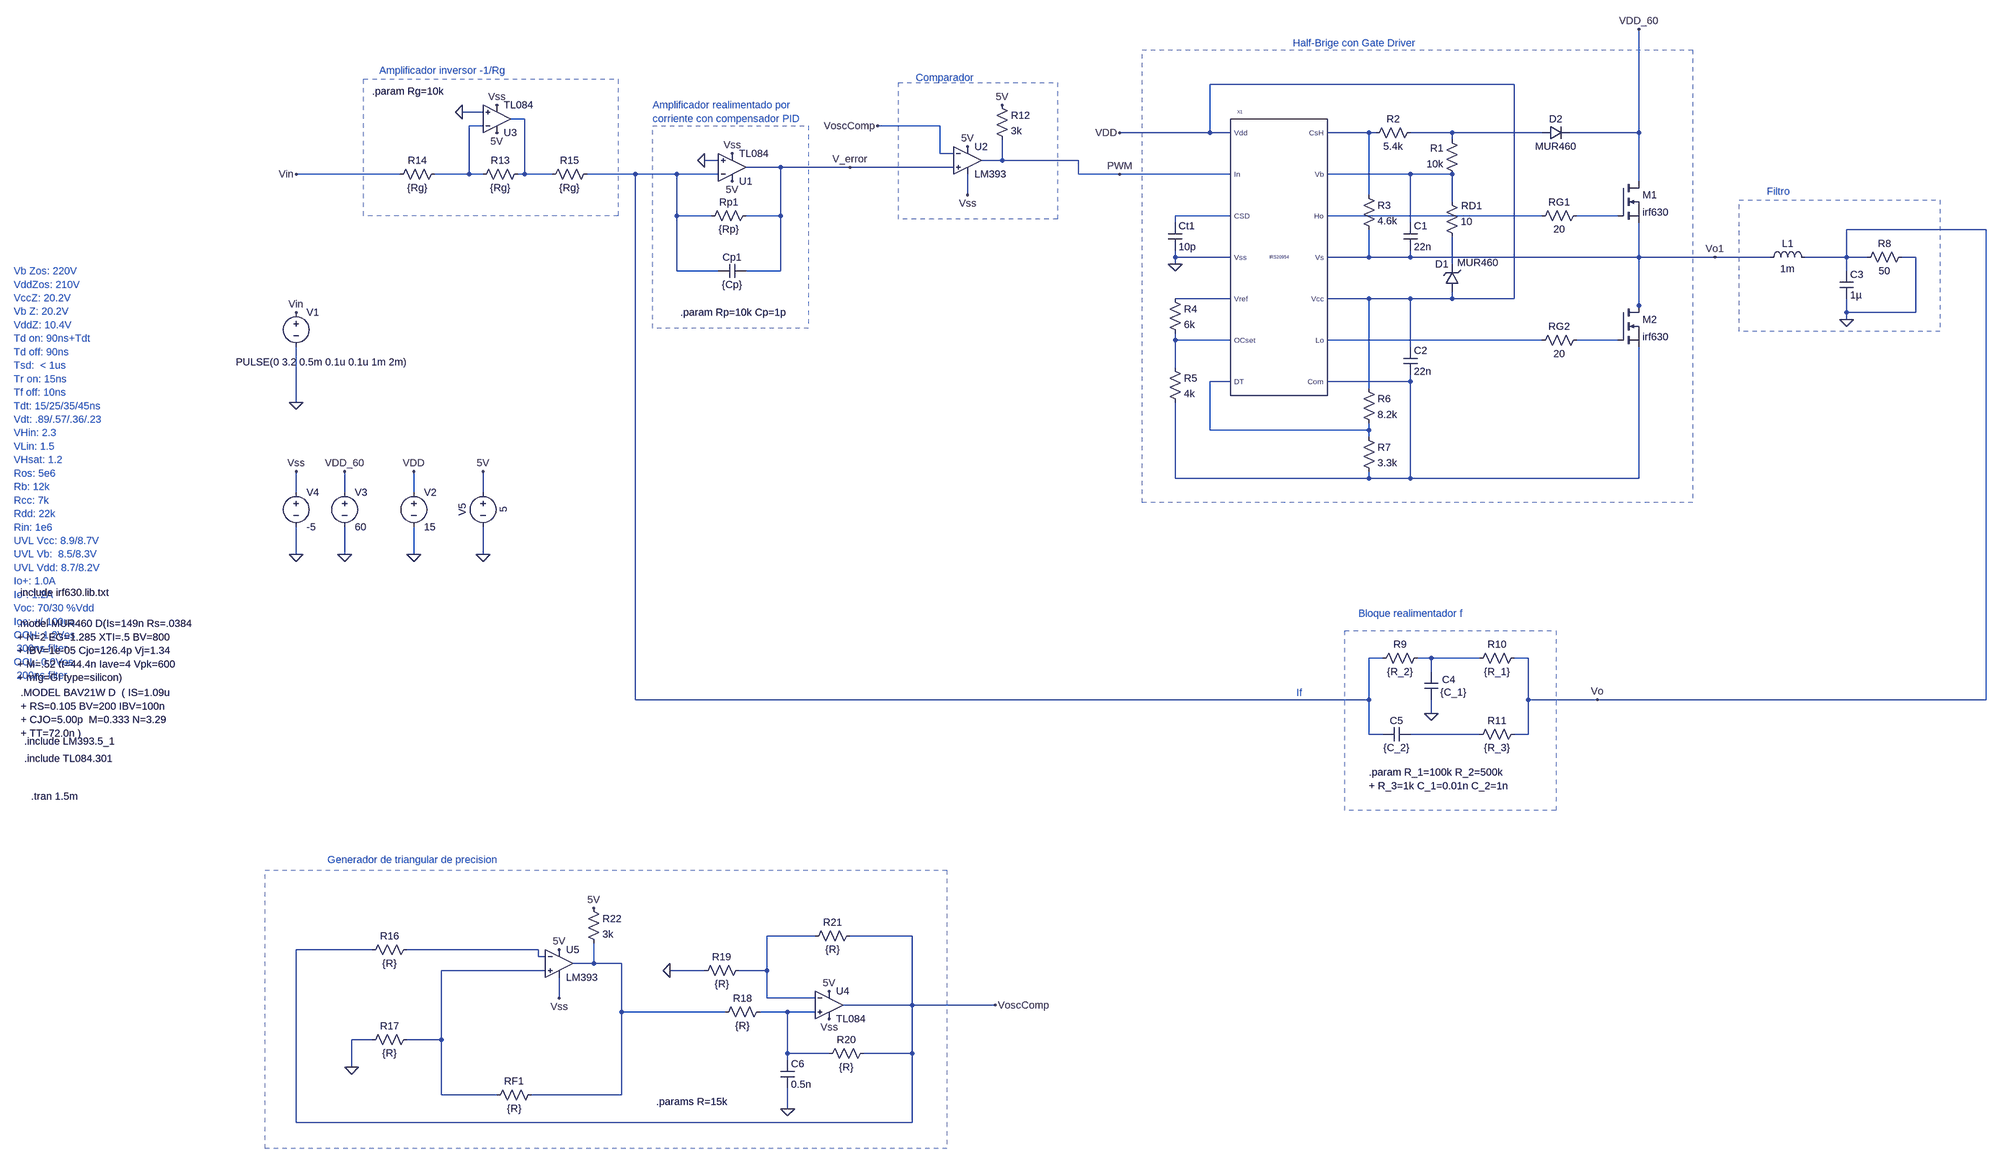
[diagram p0: schematic Circuito de Potencia.asc]
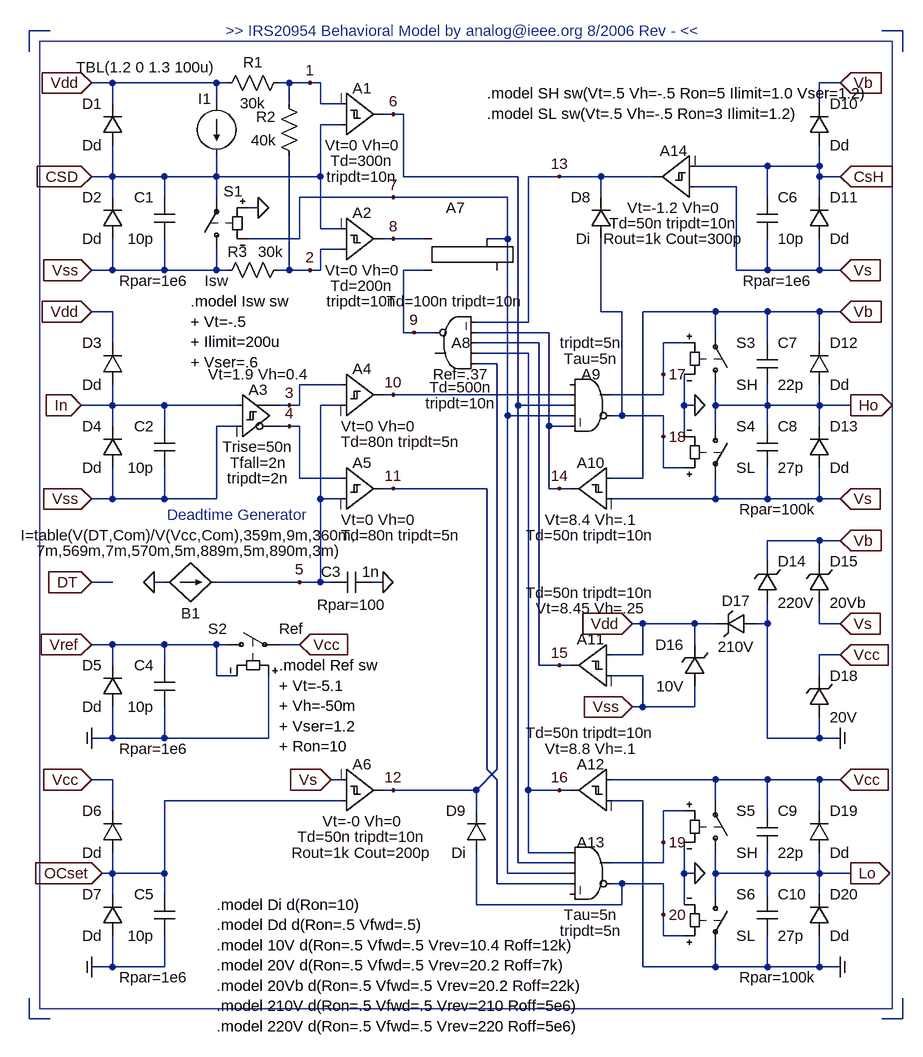
[diagram p1: sub-circuit irs20954.asc]
Circuito de Potencia.asc, the LTspice schematic file:
Version 4
SHEET 1 1964 2416
WIRE 768 -128 64 -128
WIRE -1616 -64 -1664 -64
WIRE -1520 -48 -1552 -48
WIRE -1616 -32 -1648 -32
WIRE -560 -32 -704 -32
WIRE 64 -16 64 -128
WIRE 64 -16 -144 -16
WIRE 112 -16 64 -16
WIRE 432 -16 336 -16
WIRE 448 -16 432 -16
WIRE 624 -16 528 -16
WIRE 832 -16 624 -16
WIRE 1056 -16 1056 -256
WIRE 1056 -16 896 -16
WIRE 624 0 624 -16
WIRE -560 32 -560 -32
WIRE -528 32 -560 32
WIRE -1072 48 -1104 48
WIRE -416 48 -416 0
WIRE -416 48 -464 48
WIRE -240 48 -416 48
WIRE -928 64 -1008 64
WIRE -768 64 -928 64
WIRE -528 64 -768 64
WIRE -1808 80 -2048 80
WIRE -1648 80 -1648 -32
WIRE -1648 80 -1728 80
WIRE -1616 80 -1648 80
WIRE -1520 80 -1520 -48
WIRE -1520 80 -1536 80
WIRE -1456 80 -1520 80
WIRE -1264 80 -1376 80
WIRE -1168 80 -1264 80
WIRE -1072 80 -1168 80
WIRE -240 80 -240 48
WIRE -144 80 -240 80
WIRE 112 80 -144 80
WIRE 528 80 336 80
WIRE 624 80 528 80
WIRE 1056 96 1056 -16
WIRE -496 128 -496 80
WIRE 432 128 432 -16
WIRE 624 144 624 80
WIRE -1168 176 -1168 80
WIRE -1088 176 -1168 176
WIRE -928 176 -928 64
WIRE -928 176 -1008 176
WIRE 112 176 -16 176
WIRE 832 176 336 176
WIRE 1008 176 912 176
WIRE -16 192 -16 176
WIRE 528 192 528 80
WIRE 1872 208 1536 208
WIRE -16 272 -16 256
WIRE 112 272 -16 272
WIRE 432 272 432 208
WIRE 432 272 336 272
WIRE 528 272 528 256
WIRE 528 272 432 272
WIRE 1056 272 1056 192
WIRE 1056 272 528 272
WIRE 1232 272 1056 272
WIRE 1360 272 1232 272
WIRE 1536 272 1536 208
WIRE 1536 272 1440 272
WIRE 1584 272 1536 272
WIRE 1696 272 1664 272
WIRE -16 288 -16 272
WIRE 624 288 624 224
WIRE -1168 304 -1168 176
WIRE -1072 304 -1168 304
WIRE -928 304 -928 176
WIRE -928 304 -1008 304
WIRE 1536 304 1536 272
WIRE 112 368 -16 368
WIRE 432 368 336 368
WIRE 528 368 432 368
WIRE 624 368 624 352
WIRE 624 368 528 368
WIRE 768 368 768 -128
WIRE 768 368 624 368
WIRE 1056 384 1056 272
WIRE 1056 400 1056 384
WIRE 1536 400 1536 368
WIRE 1696 400 1696 272
WIRE 1696 400 1536 400
WIRE 1536 416 1536 400
WIRE -16 464 -16 448
WIRE 112 464 -16 464
WIRE 832 464 336 464
WIRE 1008 464 912 464
WIRE 528 480 528 368
WIRE -16 528 -16 464
WIRE 112 560 64 560
WIRE 528 560 528 544
WIRE 528 560 336 560
WIRE 432 576 432 368
WIRE -2048 608 -2048 480
WIRE 64 672 64 560
WIRE 432 672 432 656
WIRE 432 672 64 672
WIRE 432 688 432 672
WIRE -16 784 -16 608
WIRE 432 784 432 768
WIRE 432 784 -16 784
WIRE 528 784 528 560
WIRE 528 784 432 784
WIRE 1056 784 1056 480
WIRE 1056 784 528 784
WIRE -2048 816 -2048 768
WIRE -1936 816 -1936 768
WIRE -1776 816 -1776 768
WIRE -1616 816 -1616 768
WIRE -2048 960 -2048 896
WIRE -1936 960 -1936 896
WIRE -1776 960 -1776 896
WIRE -1616 960 -1616 896
WIRE 464 1200 432 1200
WIRE 576 1200 544 1200
WIRE 688 1200 576 1200
WIRE 800 1200 768 1200
WIRE 576 1232 576 1200
WIRE -1264 1296 -1264 80
WIRE 432 1296 432 1200
WIRE 432 1296 -1264 1296
WIRE 800 1296 800 1200
WIRE 960 1296 800 1296
WIRE 1872 1296 1872 208
WIRE 1872 1296 960 1296
WIRE 576 1328 576 1296
WIRE 432 1376 432 1296
WIRE 464 1376 432 1376
WIRE 688 1376 528 1376
WIRE 800 1376 800 1296
WIRE 800 1376 768 1376
WIRE -848 1856 -960 1856
WIRE -624 1856 -768 1856
WIRE -1872 1888 -2048 1888
WIRE -1488 1888 -1792 1888
WIRE -1488 1904 -1488 1888
WIRE -1472 1904 -1488 1904
WIRE -1360 1920 -1360 1872
WIRE -1360 1920 -1408 1920
WIRE -1296 1920 -1360 1920
WIRE -1472 1936 -1712 1936
WIRE -1104 1936 -1184 1936
WIRE -960 1936 -960 1856
WIRE -960 1936 -1024 1936
WIRE -1440 2000 -1440 1952
WIRE -960 2000 -960 1936
WIRE -848 2000 -960 2000
WIRE -624 2016 -624 1856
WIRE -624 2016 -784 2016
WIRE -432 2016 -624 2016
WIRE -1296 2032 -1296 1920
WIRE -1056 2032 -1296 2032
WIRE -912 2032 -976 2032
WIRE -848 2032 -912 2032
WIRE -1872 2096 -1920 2096
WIRE -1712 2096 -1712 1936
WIRE -1712 2096 -1792 2096
WIRE -912 2128 -912 2032
WIRE -816 2128 -912 2128
WIRE -624 2128 -624 2016
WIRE -624 2128 -736 2128
WIRE -912 2144 -912 2128
WIRE -1920 2160 -1920 2096
WIRE -1712 2224 -1712 2096
WIRE -1584 2224 -1712 2224
WIRE -1296 2224 -1296 2032
WIRE -1296 2224 -1504 2224
WIRE -912 2256 -912 2208
WIRE -2048 2288 -2048 1888
WIRE -624 2288 -624 2128
WIRE -624 2288 -2048 2288
FLAG 1056 -256 VDD_60
FLAG -144 -16 VDD
FLAG -16 288 0
FLAG 1232 272 Vo1
FLAG -144 80 PWM
FLAG 1536 416 0
FLAG 576 1328 0
FLAG 960 1296 Vo
FLAG -768 64 V_error
FLAG -1040 32 Vss
FLAG -1040 96 5V
FLAG -416 -80 5V
FLAG -496 128 Vss
FLAG -496 16 5V
FLAG -1664 -64 0
FLAG -1584 -80 Vss
FLAG -1584 -16 5V
FLAG -704 -32 VoscComp
FLAG -1104 48 0
FLAG -2048 80 Vin
FLAG -2048 608 0
FLAG -2048 400 Vin
FLAG -1936 960 0
FLAG -1936 768 VDD_60
FLAG -1776 960 0
FLAG -1776 768 VDD
FLAG -2048 960 0
FLAG -2048 768 Vss
FLAG -1920 2160 0
FLAG -1184 1936 0
FLAG -912 2256 0
FLAG -816 2048 Vss
FLAG -816 1984 5V
FLAG -1360 1792 5V
FLAG -1440 2000 Vss
FLAG -432 2016 VoscComp
FLAG -1616 960 0
FLAG -1616 768 5V
FLAG -1440 1888 5V
SYMBOL IRS20954 224 272 R0
SYMATTR InstName X1
SYMBOL cap 512 192 R0
SYMATTR InstName C1
SYMATTR Value 22n
SYMBOL cap -32 192 R0
SYMATTR InstName Ct1
SYMATTR Value 10p
SYMBOL cap 512 480 R0
SYMATTR InstName C2
SYMATTR Value 22n
SYMBOL nmos 1008 96 R0
SYMATTR InstName M1
SYMATTR Value irf630
SYMATTR Prefix X
SYMBOL nmos 1008 384 R0
SYMATTR InstName M2
SYMATTR Value irf630
SYMATTR Prefix X
SYMBOL zener 640 352 R180
WINDOW 0 24 64 Left 2
WINDOW 3 -91 67 Left 2
SYMATTR InstName D1
SYMATTR Value MUR460
SYMBOL res 608 128 R0
WINDOW 0 37 25 Left 2
WINDOW 3 36 62 Left 2
SYMATTR InstName RD1
SYMATTR Value 10
SYMBOL res 928 160 R90
WINDOW 0 0 56 VBottom 2
WINDOW 3 32 56 VTop 2
SYMATTR InstName RG1
SYMATTR Value 20
SYMBOL res 928 448 R90
WINDOW 0 0 56 VBottom 2
WINDOW 3 32 56 VTop 2
SYMATTR InstName RG2
SYMATTR Value 20
SYMBOL res 416 112 R0
SYMATTR InstName R3
SYMATTR Value 4.6k
SYMBOL res 544 -32 R90
WINDOW 0 0 56 VBottom 2
WINDOW 3 32 56 VTop 2
SYMATTR InstName R2
SYMATTR Value 5.4k
SYMBOL res 640 96 R180
WINDOW 0 36 76 Left 2
WINDOW 3 36 40 Left 2
SYMATTR InstName R1
SYMATTR Value 10k
SYMBOL diode 832 0 R270
WINDOW 0 32 32 VTop 2
WINDOW 3 0 32 VBottom 2
SYMATTR InstName D2
SYMATTR Value MUR460
SYMBOL res -32 512 R0
SYMATTR InstName R5
SYMATTR Value 4k
SYMBOL res -32 352 R0
SYMATTR InstName R4
SYMATTR Value 6k
SYMBOL res 416 560 R0
SYMATTR InstName R6
SYMATTR Value 8.2k
SYMBOL res 416 672 R0
SYMATTR InstName R7
SYMATTR Value 3.3k
SYMBOL ind 1344 288 R270
WINDOW 0 32 56 VTop 2
WINDOW 3 5 56 VBottom 2
SYMATTR InstName L1
SYMATTR Value 1m
SYMBOL cap 1520 304 R0
SYMATTR InstName C3
SYMATTR Value 1µ
SYMBOL res 1680 256 R90
WINDOW 0 0 56 VBottom 2
WINDOW 3 32 56 VTop 2
SYMATTR InstName R8
SYMATTR Value 50
SYMBOL res 560 1184 R90
WINDOW 0 0 56 VBottom 2
WINDOW 3 32 56 VTop 2
SYMATTR InstName R9
SYMATTR Value {R_2}
SYMBOL res 784 1184 R90
WINDOW 0 0 56 VBottom 2
WINDOW 3 32 56 VTop 2
SYMATTR InstName R10
SYMATTR Value {R_1}
SYMBOL cap 592 1296 R180
WINDOW 0 -40 46 Left 2
WINDOW 3 -66 17 Left 2
SYMATTR InstName C4
SYMATTR Value {C_1}
SYMBOL cap 528 1360 R90
WINDOW 0 0 32 VBottom 2
WINDOW 3 32 32 VTop 2
SYMATTR InstName C5
SYMATTR Value {C_2}
SYMBOL res 784 1360 R90
WINDOW 0 0 56 VBottom 2
WINDOW 3 32 56 VTop 2
SYMATTR InstName R11
SYMATTR Value {R_3}
SYMBOL res -992 160 R90
WINDOW 0 0 56 VBottom 2
WINDOW 3 32 56 VTop 2
SYMATTR InstName Rp1
SYMATTR Value {Rp}
SYMBOL cap -1008 288 R90
WINDOW 0 0 32 VBottom 2
WINDOW 3 32 32 VTop 2
SYMATTR InstName Cp1
SYMATTR Value {Cp}
SYMBOL opamp2 -1040 128 M180
SYMATTR InstName U1
SYMATTR Value TL084
SYMBOL opamp2 -496 -16 R0
SYMATTR InstName U2
SYMATTR Value LM393
SYMBOL res -432 -96 R0
SYMATTR InstName R12
SYMATTR Value 3k
SYMBOL res -1520 64 R90
WINDOW 0 0 56 VBottom 2
WINDOW 3 32 56 VTop 2
SYMATTR InstName R13
SYMATTR Value {Rg}
SYMBOL res -1712 64 R90
WINDOW 0 0 56 VBottom 2
WINDOW 3 32 56 VTop 2
SYMATTR InstName R14
SYMATTR Value {Rg}
SYMBOL res -1360 64 R90
WINDOW 0 0 56 VBottom 2
WINDOW 3 32 56 VTop 2
SYMATTR InstName R15
SYMATTR Value {Rg}
SYMBOL opamp2 -1584 16 M180
SYMATTR InstName U3
SYMATTR Value TL084
SYMBOL voltage -2048 384 R0
WINDOW 123 0 0 Left 2
WINDOW 39 0 0 Left 2
WINDOW 3 -139 131 Left 2
SYMATTR Value PULSE(0 3.2 0.5m 0.1u 0.1u 1m 2m)
SYMATTR InstName V1
SYMBOL voltage -1776 800 R0
SYMATTR InstName V2
SYMATTR Value 15
SYMBOL voltage -1936 800 R0
WINDOW 123 0 0 Left 2
WINDOW 39 0 0 Left 2
SYMATTR InstName V3
SYMATTR Value 60
SYMBOL voltage -2048 800 R0
WINDOW 123 0 0 Left 2
WINDOW 39 0 0 Left 2
SYMATTR InstName V4
SYMATTR Value -5
SYMBOL res -1776 1872 R90
WINDOW 0 0 56 VBottom 2
WINDOW 3 32 56 VTop 2
SYMATTR InstName R16
SYMATTR Value {R}
SYMBOL res -1776 2080 R90
WINDOW 0 0 56 VBottom 2
WINDOW 3 32 56 VTop 2
SYMATTR InstName R17
SYMATTR Value {R}
SYMBOL res -1488 2208 R90
WINDOW 0 0 56 VBottom 2
WINDOW 3 32 56 VTop 2
SYMATTR InstName RF1
SYMATTR Value {R}
SYMBOL res -1072 2048 R270
WINDOW 0 32 56 VTop 2
WINDOW 3 0 56 VBottom 2
SYMATTR InstName R18
SYMATTR Value {R}
SYMBOL res -1008 1920 R90
WINDOW 0 0 56 VBottom 2
WINDOW 3 32 56 VTop 2
SYMATTR InstName R19
SYMATTR Value {R}
SYMBOL res -720 2112 R90
WINDOW 0 0 56 VBottom 2
WINDOW 3 32 56 VTop 2
SYMATTR InstName R20
SYMATTR Value {R}
SYMBOL cap -928 2144 R0
SYMATTR InstName C6
SYMATTR Value 0.5n
SYMBOL res -752 1840 R90
WINDOW 0 0 56 VBottom 2
WINDOW 3 32 56 VTop 2
SYMATTR InstName R21
SYMATTR Value {R}
SYMBOL opamp2 -816 1952 R0
SYMATTR InstName U4
SYMATTR Value TL084
SYMBOL opamp2 -1440 1856 R0
SYMATTR InstName U5
SYMATTR Value LM393
SYMBOL res -1376 1776 R0
SYMATTR InstName R22
SYMATTR Value 3k
SYMBOL voltage -1616 800 R0
WINDOW 0 -32 56 VBottom 2
WINDOW 3 32 56 VTop 2
WINDOW 123 0 0 Left 2
WINDOW 39 0 0 Left 2
SYMATTR InstName V5
SYMATTR Value 5
TEXT 256 -224 Left 2 ;Half-Brige con Gate Driver
TEXT 1352 120 Left 2 ;Filtro
TEXT 408 1096 Left 2 ;Bloque realimentador f
TEXT -1872 -112 Left 2 !.param Rg=10k
TEXT -1856 -160 Left 2 ;Amplificador inversor -1/Rg
TEXT -1224 -80 Left 2 ;Amplificador realimentado por \ncorriente con compensador PID
TEXT -1160 400 Left 2 !.param Rp=10k Cp=1p
TEXT -616 -144 Left 2 ;Comparador
TEXT -1216 2240 Left 2 !.params R=15k
TEXT -1976 1680 Left 2 ;Generador de triangular de precision
TEXT -3264 304 Left 2 ;Vb Zos: 220V\nVddZos: 210V\nVccZ: 20.2V\nVb Z: 20.2V\nVddZ: 10.4V\nTd on: 90ns+Tdt\nTd off: 90ns\nTsd:  < 1us\nTr on: 15ns\nTf off: 10ns\nTdt: 15/25/35/45ns\nVdt: .89/.57/.36/.23\nVHin: 2.3\nVLin: 1.5\nVHsat: 1.2\nRos: 5e6\nRb: 12k\nRcc: 7k\nRdd: 22k\nRin: 1e6\nUVL Vcc: 8.9/8.7V\nUVL Vb:  8.5/8.3V\nUVL Vdd: 8.7/8.2V\nIo+: 1.0A\nIo-: 1.2A\nVoc: 70/30 %Vdd\nIoc: +/-100ua\nOCH: 1.2Vos\n 300ns filter\nOCL: 0.0Vos\n 200ns filter
TEXT -3256 1048 Left 2 !.include irf630.lib.txt
TEXT -3256 1120 Left 2 !.model MUR460 D(Is=149n Rs=.0384 \n+ N=2 EG=1.285 XTI=.5 BV=800 \n+ IBV=1e-05 Cjo=126.4p Vj=1.34 \n+ M=.52 tt=44.4n Iave=4 Vpk=600 \n+ mfg=GI type=silicon)
TEXT -3248 1280 Left 2 !.MODEL BAV21W D  ( IS=1.09u \n+ RS=0.105 BV=200 IBV=100n\n+ CJO=5.00p  M=0.333 N=3.29 \n+ TT=72.0n )
TEXT -3240 1392 Left 2 !.include LM393.5_1
TEXT -3240 1432 Left 2 !.include TL084.301
TEXT -3224 1520 Left 2 !.tran 1.5m
TEXT 432 1464 Left 2 !.param R_1=100k R_2=500k \n+ R_3=1k C_1=0.01n C_2=1n
TEXT 264 1280 Left 2 ;If
RECTANGLE Normal -92 -208 1180 840 2
RECTANGLE Normal 1288 140 1752 444 2
RECTANGLE Normal -1892 -140 -1304 176 2
RECTANGLE Normal -1224 -32 -864 436 2
RECTANGLE Normal -656 -132 -288 184 2
RECTANGLE Normal -2120 1704 -544 2348 2
RECTANGLE Normal 376 1136 864 1552 2

irs20954.asc, the sub-circuit schematic file:
Version 4
SHEET 1 13828 1048
WIRE -480 -576 -512 -576
WIRE 832 -576 800 -576
WIRE -512 -544 -512 -576
WIRE 832 -544 832 -576
WIRE -384 -496 -416 -496
WIRE -224 -496 -384 -496
WIRE -208 -496 -224 -496
WIRE -112 -496 -128 -496
WIRE -80 -496 -112 -496
WIRE -64 -496 -80 -496
WIRE 736 -496 704 -496
WIRE -384 -464 -384 -496
WIRE -224 -464 -224 -496
WIRE -112 -464 -112 -496
WIRE -64 -464 -64 -496
WIRE -32 -464 -64 -464
WIRE 704 -464 704 -496
WIRE 48 -448 32 -448
WIRE 64 -448 48 -448
WIRE -32 -432 -64 -432
WIRE 624 -368 512 -368
WIRE 704 -368 704 -400
WIRE 704 -368 624 -368
WIRE -384 -352 -384 -400
WIRE -384 -352 -416 -352
WIRE -304 -352 -384 -352
WIRE -224 -352 -224 -384
WIRE -224 -352 -304 -352
WIRE -64 -352 -64 -432
WIRE -64 -352 -224 -352
WIRE 64 -352 64 -448
WIRE 240 -352 64 -352
WIRE 304 -352 256 -352
WIRE 368 -352 304 -352
WIRE 448 -352 368 -352
WIRE 704 -352 704 -368
WIRE 736 -352 704 -352
WIRE 576 -336 512 -336
WIRE -384 -320 -384 -352
WIRE -304 -320 -304 -352
WIRE -224 -320 -224 -352
WIRE 48 -320 -96 -320
WIRE 224 -320 48 -320
WIRE 368 -320 368 -352
WIRE 624 -320 624 -368
WIRE 704 -320 704 -352
WIRE -160 -304 -176 -304
WIRE -64 -272 -64 -352
WIRE -32 -272 -64 -272
WIRE -96 -256 -96 -320
WIRE -96 -256 -176 -256
WIRE 48 -256 32 -256
WIRE 96 -256 48 -256
WIRE 224 -256 224 -320
WIRE 224 -256 192 -256
WIRE -32 -240 -64 -240
WIRE -384 -208 -384 -256
WIRE -384 -208 -416 -208
WIRE -304 -208 -304 -256
WIRE -304 -208 -384 -208
WIRE -224 -208 -224 -240
WIRE -224 -208 -304 -208
WIRE -208 -208 -224 -208
WIRE -112 -208 -112 -384
WIRE -112 -208 -128 -208
WIRE -80 -208 -112 -208
WIRE -64 -208 -64 -240
WIRE -64 -208 -80 -208
WIRE 96 -208 64 -208
WIRE 576 -208 576 -336
WIRE 624 -208 624 -256
WIRE 624 -208 576 -208
WIRE 704 -208 704 -256
WIRE 704 -208 624 -208
WIRE 736 -208 704 -208
WIRE -384 -144 -416 -144
WIRE 368 -144 368 -256
WIRE 400 -144 368 -144
WIRE 544 -144 432 -144
WIRE 624 -144 544 -144
WIRE 704 -144 624 -144
WIRE 736 -144 704 -144
WIRE 256 -128 256 -352
WIRE 256 -128 176 -128
WIRE 64 -112 64 -208
WIRE 80 -112 64 -112
WIRE 112 -112 80 -112
WIRE 288 -112 176 -112
WIRE 544 -112 544 -144
WIRE -384 -96 -384 -144
WIRE 272 -96 176 -96
WIRE 496 -96 464 -96
WIRE 624 -96 624 -144
WIRE 704 -96 704 -144
WIRE 256 -80 176 -80
WIRE 208 -64 176 -64
WIRE 464 -48 464 -96
WIRE -32 -32 -96 -32
WIRE 48 -16 32 -16
WIRE 320 -16 48 -16
WIRE 464 -16 464 -48
WIRE 464 -16 384 -16
WIRE -384 0 -384 -32
WIRE -384 0 -432 0
WIRE -304 0 -384 0
WIRE -192 0 -304 0
WIRE -112 0 -128 0
WIRE -96 0 -96 -32
WIRE -96 0 -112 0
WIRE -32 0 -64 0
WIRE 240 0 240 -352
WIRE 320 0 240 0
WIRE 496 0 496 -48
WIRE 512 0 496 0
WIRE 544 0 544 -32
WIRE 624 0 624 -32
WIRE 624 0 544 0
WIRE 704 0 704 -32
WIRE 704 0 624 0
WIRE 752 0 704 0
WIRE 224 16 224 -256
WIRE 320 16 224 16
WIRE 400 16 400 -144
WIRE 400 16 384 16
WIRE 464 16 400 16
WIRE -384 32 -384 0
WIRE -304 32 -304 0
WIRE -192 32 -224 32
WIRE -112 32 -128 32
WIRE -96 32 -112 32
WIRE 288 32 288 -112
WIRE 320 32 288 32
WIRE 544 32 544 0
WIRE 624 32 624 0
WIRE 704 32 704 0
WIRE 464 48 464 16
WIRE 496 48 496 0
WIRE 464 96 464 48
WIRE 496 96 464 96
WIRE -96 112 -96 32
WIRE -32 112 -96 112
WIRE 432 112 432 -144
WIRE 432 112 384 112
WIRE 48 128 32 128
WIRE 192 128 48 128
WIRE 288 128 288 32
WIRE 304 128 288 128
WIRE 320 128 304 128
WIRE -384 144 -384 96
WIRE -384 144 -416 144
WIRE -304 144 -304 96
WIRE -304 144 -384 144
WIRE -224 144 -224 32
WIRE -224 144 -304 144
WIRE -64 144 -64 0
WIRE -32 144 -64 144
WIRE 544 144 544 112
WIRE 544 144 384 144
WIRE 624 144 624 96
WIRE 624 144 544 144
WIRE 704 144 704 96
WIRE 704 144 624 144
WIRE 736 144 704 144
WIRE 704 208 624 208
WIRE 736 208 704 208
WIRE 624 240 624 208
WIRE 704 240 704 208
WIRE -384 272 -416 272
WIRE -304 272 -320 272
WIRE -96 272 -224 272
WIRE -64 272 -64 144
WIRE -64 272 -96 272
WIRE -48 272 -64 272
WIRE 32 272 16 272
WIRE 432 336 416 336
WIRE 512 336 432 336
WIRE 544 336 512 336
WIRE 624 336 624 304
WIRE 624 336 608 336
WIRE 704 336 704 304
WIRE 736 336 704 336
WIRE -384 368 -416 368
WIRE -304 368 -384 368
WIRE -224 368 -304 368
WIRE -208 368 -224 368
WIRE -96 368 -128 368
WIRE 512 368 512 336
WIRE 432 384 432 336
WIRE 432 384 384 384
WIRE 736 384 704 384
WIRE -384 400 -384 368
WIRE -304 400 -304 368
WIRE 272 400 272 -96
WIRE 304 400 272 400
WIRE 320 400 304 400
WIRE -224 416 -224 368
WIRE -192 416 -224 416
WIRE 432 416 384 416
WIRE 704 416 704 384
WIRE 432 464 432 416
WIRE 432 464 416 464
WIRE 512 464 512 432
WIRE 512 464 432 464
WIRE -384 512 -384 464
WIRE -384 512 -416 512
WIRE -304 512 -304 464
WIRE -304 512 -384 512
WIRE -144 512 -144 416
WIRE -144 512 -304 512
WIRE 624 512 624 336
WIRE 704 512 704 480
WIRE 704 512 624 512
WIRE 736 512 704 512
WIRE 192 560 192 128
WIRE 208 560 208 -64
WIRE -384 576 -416 576
WIRE -32 576 -48 576
WIRE 208 576 192 560
WIRE 544 576 384 576
WIRE 624 576 544 576
WIRE 704 576 624 576
WIRE 736 576 704 576
WIRE 48 592 32 592
WIRE 176 592 208 560
WIRE 176 592 48 592
WIRE 256 592 256 -80
WIRE 304 592 256 592
WIRE 320 592 304 592
WIRE -32 608 -304 608
WIRE 432 608 384 608
WIRE 544 608 544 576
WIRE -384 624 -384 576
WIRE 176 624 176 592
WIRE 496 624 464 624
WIRE 624 624 624 576
WIRE 704 624 704 576
WIRE 464 672 464 624
WIRE 256 688 256 592
WIRE 320 688 256 688
WIRE 240 704 240 0
WIRE 320 704 240 704
WIRE 464 704 464 672
WIRE 464 704 384 704
WIRE -384 720 -384 688
WIRE -384 720 -400 720
WIRE -304 720 -304 608
WIRE -304 720 -384 720
WIRE 224 720 224 16
WIRE 320 720 224 720
WIRE 496 720 496 672
WIRE 512 720 496 720
WIRE 544 720 544 688
WIRE 624 720 624 688
WIRE 624 720 544 720
WIRE 704 720 704 688
WIRE 704 720 624 720
WIRE 752 720 704 720
WIRE 208 736 208 576
WIRE 320 736 208 736
WIRE 400 736 384 736
WIRE 464 736 400 736
WIRE -384 752 -384 720
WIRE -304 752 -304 720
WIRE 544 752 544 720
WIRE 624 752 624 720
WIRE 704 752 704 720
WIRE 176 768 176 688
WIRE 400 768 400 736
WIRE 400 768 176 768
WIRE 496 768 496 720
WIRE 464 784 464 736
WIRE 464 816 464 784
WIRE 496 816 464 816
WIRE -384 864 -384 816
WIRE -384 864 -416 864
WIRE -304 864 -304 816
WIRE -304 864 -384 864
WIRE 432 864 432 608
WIRE 544 864 544 832
WIRE 544 864 432 864
WIRE 624 864 624 816
WIRE 624 864 544 864
WIRE 704 864 704 816
WIRE 704 864 624 864
WIRE 736 864 704 864
WIRE -512 944 -512 912
WIRE -480 944 -512 944
WIRE 832 944 832 912
WIRE 832 944 800 944
FLAG 752 0 Ho
IOPIN 752 0 Out
FLAG -432 0 In
IOPIN -432 0 In
FLAG -416 -144 Vdd
IOPIN -416 -144 In
FLAG 736 -144 Vb
IOPIN 736 -144 In
FLAG 736 144 Vs
IOPIN 736 144 In
FLAG -416 144 Vss
IOPIN -416 144 In
FLAG 736 512 Com
IOPIN 736 512 In
FLAG 736 576 Vcc
IOPIN 736 576 In
FLAG 736 864 Com
IOPIN 736 864 In
FLAG 752 720 Lo
IOPIN 752 720 Out
FLAG -96 272 5
FLAG 512 720 0
FLAG 512 0 0
FLAG 80 -112 9
FLAG 464 -48 17
FLAG 464 48 18
FLAG 736 384 Vcc
IOPIN 736 384 In
FLAG 736 208 Vb
IOPIN 736 208 In
FLAG 736 336 Vs
IOPIN 736 336 In
FLAG -112 0 3
FLAG 304 -352 13
FLAG 304 128 14
FLAG -112 32 4
FLAG 48 -16 10
FLAG -400 720 OCset
IOPIN -400 720 In
FLAG 32 272 0
FLAG -320 272 0
FLAG -416 272 DT
IOPIN -416 272 In
FLAG 464 672 19
FLAG 464 784 20
FLAG 416 464 Vss
IOPIN 416 464 In
FLAG 416 336 Vdd
IOPIN 416 336 In
FLAG 736 -352 CsH
IOPIN 736 -352 In
FLAG 736 -496 Vb
IOPIN 736 -496 In
FLAG 736 -208 Vs
IOPIN 736 -208 In
FLAG -416 -352 CSD
IOPIN -416 -352 In
FLAG -416 -496 Vdd
IOPIN -416 -496 In
FLAG -416 -208 Vss
IOPIN -416 -208 In
FLAG -160 -304 0
FLAG -416 368 Vref
IOPIN -416 368 In
FLAG -48 576 Vs
IOPIN -48 576 In
FLAG -416 576 Vcc
IOPIN -416 576 In
FLAG -416 864 Com
IOPIN -416 864 In
FLAG -80 -496 1
FLAG -80 -208 2
FLAG 48 128 11
FLAG 48 -448 6
FLAG 48 -320 7
FLAG 48 -256 8
FLAG 48 592 12
FLAG 304 400 15
FLAG 304 592 16
FLAG -96 368 Vcc
IOPIN -96 368 In
FLAG -416 512 Com
IOPIN -416 512 In
SYMBOL diode -368 -400 R180
WINDOW 0 32 64 Left 0
WINDOW 3 32 0 Left 0
SYMATTR InstName D1
SYMATTR Value Dd
SYMBOL diode -368 -256 R180
WINDOW 0 32 64 Left 0
WINDOW 3 32 0 Left 0
SYMATTR InstName D2
SYMATTR Value Dd
SYMBOL cap -288 -320 M0
WINDOW 0 32 0 Left 0
WINDOW 3 32 64 Left 0
WINDOW 39 32 128 Center 0
SYMATTR InstName C1
SYMATTR Value 10p
SYMATTR SpiceLine Rpar=1e6
SYMBOL current -224 -464 R0
WINDOW 123 0 0 Left 0
WINDOW 39 0 0 Left 0
WINDOW 3 0 -56 Right 0
WINDOW 0 -8 -8 Right 0
SYMATTR Value TBL(1.2 0 1.3 100u)
SYMATTR InstName I1
SYMBOL sw -224 -224 R180
WINDOW 0 -11 105 Right 0
WINDOW 3 0 -32 Center 0
SYMATTR InstName S1
SYMATTR Value Isw
SYMBOL res -224 -480 R270
WINDOW 0 32 56 VTop 0
WINDOW 3 0 56 VBottom 0
SYMATTR InstName R1
SYMATTR Value 30k
SYMBOL res -96 -368 R180
WINDOW 0 36 76 Left 0
WINDOW 3 36 40 Left 0
SYMATTR InstName R2
SYMATTR Value 40k
SYMBOL res -112 -224 R90
WINDOW 0 -12 64 VRight 0
WINDOW 3 -12 48 VLeft 0
SYMATTR InstName R3
SYMATTR Value 30k
SYMBOL Digital\\diffschmtbuf -32 -384 M180
WINDOW 0 32 104 Center 0
WINDOW 3 32 16 Center 0
WINDOW 123 32 -8 Center 0
WINDOW 39 32 -32 Center 0
SYMATTR InstName A1
SYMATTR Value Vt=0 Vh=0
SYMATTR Value2 Td=300n
SYMATTR SpiceLine tripdt=10n
SYMBOL Digital\\diffschmtbuf -32 -192 M180
WINDOW 0 32 104 Center 0
WINDOW 3 32 16 Center 0
WINDOW 123 32 -8 Center 0
WINDOW 39 32 -32 Center 0
SYMATTR InstName A2
SYMATTR Value Vt=0 Vh=0
SYMATTR Value2 Td=200n
SYMATTR SpiceLine tripdt=10n
SYMBOL diode -368 -32 R180
WINDOW 0 32 64 Left 0
WINDOW 3 32 0 Left 0
SYMATTR InstName D3
SYMATTR Value Dd
SYMBOL diode -368 96 R180
WINDOW 0 32 64 Left 0
WINDOW 3 32 0 Left 0
SYMATTR InstName D4
SYMATTR Value Dd
SYMBOL cap -288 32 M0
WINDOW 0 32 0 Left 0
WINDOW 3 32 64 Left 0
SYMATTR InstName C2
SYMATTR Value 10p
SYMBOL Digital\\diffschmitt -192 -48 R0
WINDOW 0 32 24 Center 0
WINDOW 3 32 0 Center 0
WINDOW 123 32 112 Center 0
WINDOW 39 32 136 Center 0
WINDOW 40 32 160 Center 0
SYMATTR InstName A3
SYMATTR Value Vt=1.9 Vh=0.4
SYMATTR Value2 Trise=50n
SYMATTR SpiceLine Tfall=2n
SYMATTR SpiceLine2 tripdt=2n
SYMBOL Digital\\diffschmtbuf -32 -80 R0
WINDOW 0 32 24 Center 0
WINDOW 3 0 112 Left 0
WINDOW 123 0 136 Left 0
SYMATTR InstName A4
SYMATTR Value Vt=0 Vh=0
SYMATTR Value2 Td=80n tripdt=5n
SYMBOL Digital\\diffschmtbuf -32 64 R0
WINDOW 0 32 24 Center 0
WINDOW 3 0 112 Left 0
WINDOW 123 0 136 Left 0
SYMATTR InstName A5
SYMATTR Value Vt=0 Vh=0
SYMATTR Value2 Td=80n tripdt=5n
SYMBOL bi -304 272 R270
WINDOW 0 -48 40 VCenter 0
WINDOW 3 72 40 VCenter 0
WINDOW 123 48 40 VCenter 0
SYMATTR InstName B1
SYMATTR Value I=table(V(DT,Com)/V(Vcc,Com),359m,9m,360m,
SYMATTR Value2 7m,569m,7m,570m,5m,889m,5m,890m,3m)
SYMBOL cap -48 256 M90
WINDOW 0 0 16 VLeft 0
WINDOW 3 0 48 VRight 0
WINDOW 39 35 32 VTop 0
SYMATTR InstName C3
SYMATTR Value 1n
SYMATTR SpiceLine Rpar=100
SYMBOL sw -224 368 R270
WINDOW 0 24 16 VLeft 0
WINDOW 3 24 96 VRight 0
SYMATTR InstName S2
SYMATTR Value Ref
SYMBOL Digital\\diffschmtbuf -32 656 M180
WINDOW 0 32 104 Center 0
WINDOW 3 32 16 Center 0
WINDOW 123 32 -8 Center 0
WINDOW 39 32 -32 Center 0
SYMATTR InstName A6
SYMATTR Value Vt=-0 Vh=0
SYMATTR Value2 Td=50n tripdt=10n
SYMATTR SpiceLine Rout=1k Cout=200p
SYMBOL Digital\\srflop 144 -304 R0
WINDOW 0 0 0 Center 0
WINDOW 3 0 144 Center 0
SYMATTR InstName A7
SYMATTR Value Td=100n tripdt=10n
SYMBOL Digital\\and 144 -32 R180
WINDOW 0 -8 64 Center 0
WINDOW 3 -8 16 Center 0
WINDOW 123 -8 -4 Center 0
WINDOW 39 -8 -29 Center 0
SYMATTR InstName A8
SYMATTR Value Ref=.37
SYMATTR Value2 Td=500n
SYMATTR SpiceLine tripdt=10n
SYMBOL Digital\\and 352 -64 R0
WINDOW 0 0 16 Center 0
WINDOW 3 0 -8 Center 0
WINDOW 123 0 -32 Center 0
SYMATTR InstName A9
SYMATTR Value Tau=5n
SYMATTR Value2 tripdt=5n
SYMBOL Digital\\diffschmtbuf 384 64 M0
WINDOW 0 32 24 Center 0
WINDOW 3 32 112 Center 0
WINDOW 123 32 136 Center 0
SYMATTR InstName A10
SYMATTR Value Vt=8.4 Vh=.1
SYMATTR Value2 Td=50n tripdt=10n
SYMBOL Digital\\diffschmtbuf 384 336 M0
WINDOW 0 32 24 Center 0
WINDOW 3 32 -24 Center 0
WINDOW 123 32 -48 Center 0
SYMATTR InstName A11
SYMATTR Value Vt=8.45 Vh=.25
SYMATTR Value2 Td=50n tripdt=10n
SYMBOL Digital\\diffschmtbuf 384 528 M0
WINDOW 0 32 24 Center 0
WINDOW 3 32 0 Center 0
WINDOW 123 32 -24 Center 0
SYMATTR InstName A12
SYMATTR Value Vt=8.8 Vh=.1
SYMATTR Value2 Td=50n tripdt=10n
SYMBOL Digital\\and 352 656 R0
WINDOW 0 0 16 Center 0
WINDOW 3 0 128 Center 0
WINDOW 123 0 152 Center 0
SYMATTR InstName A13
SYMATTR Value Tau=5n
SYMATTR Value2 tripdt=5n
SYMBOL Digital\\diffschmtbuf 512 -288 R180
WINDOW 0 32 104 Center 0
WINDOW 3 32 16 Center 0
WINDOW 123 32 -8 Center 0
WINDOW 39 32 -32 Center 0
SYMATTR InstName A14
SYMATTR Value Vt=-1.2 Vh=0
SYMATTR Value2 Td=50n tripdt=10n
SYMATTR SpiceLine Rout=1k Cout=300p
SYMBOL sw 544 -16 M180
WINDOW 0 32 80 Left 0
WINDOW 3 32 16 Left 0
SYMATTR InstName S3
SYMATTR Value SH
SYMBOL sw 544 16 R0
WINDOW 0 32 16 Left 0
WINDOW 3 32 80 Left 0
SYMATTR InstName S4
SYMATTR Value SL
SYMBOL sw 544 704 M180
WINDOW 0 32 80 Left 0
WINDOW 3 32 16 Left 0
SYMATTR InstName S5
SYMATTR Value SH
SYMBOL sw 544 736 R0
WINDOW 0 32 16 Left 0
WINDOW 3 32 80 Left 0
SYMATTR InstName S6
SYMATTR Value SL
SYMBOL diode -368 464 R180
WINDOW 0 32 64 Left 0
WINDOW 3 32 0 Left 0
SYMATTR InstName D5
SYMATTR Value Dd
SYMBOL cap -288 400 M0
WINDOW 0 32 0 Left 0
WINDOW 3 32 64 Left 0
WINDOW 39 32 128 Center 0
SYMATTR InstName C4
SYMATTR Value 10p
SYMATTR SpiceLine Rpar=1e6
SYMBOL cap -288 752 M0
WINDOW 0 32 0 Left 0
WINDOW 3 32 64 Left 0
WINDOW 39 32 128 Center 0
SYMATTR InstName C5
SYMATTR Value 10p
SYMATTR SpiceLine Rpar=1e6
SYMBOL cap 608 -320 R0
WINDOW 0 32 0 Left 0
WINDOW 3 32 64 Left 0
WINDOW 39 32 128 Center 0
SYMATTR InstName C6
SYMATTR Value 10p
SYMATTR SpiceLine Rpar=1e6
SYMBOL cap 608 -96 R0
WINDOW 0 32 0 Left 0
WINDOW 3 32 64 Left 0
SYMATTR InstName C7
SYMATTR Value 22p
SYMBOL cap 608 32 R0
WINDOW 0 32 0 Left 0
WINDOW 3 32 64 Left 0
WINDOW 39 32 128 Center 0
SYMATTR InstName C8
SYMATTR Value 27p
SYMATTR SpiceLine Rpar=100k
SYMBOL cap 608 624 R0
WINDOW 0 32 0 Left 0
WINDOW 3 32 64 Left 0
SYMATTR InstName C9
SYMATTR Value 22p
SYMBOL cap 608 752 R0
WINDOW 0 32 0 Left 0
WINDOW 3 32 64 Left 0
WINDOW 39 32 128 Center 0
SYMATTR InstName C10
SYMATTR Value 27p
SYMATTR SpiceLine Rpar=100k
SYMBOL diode -368 688 R180
WINDOW 0 32 64 Left 0
WINDOW 3 32 0 Left 0
SYMATTR InstName D6
SYMATTR Value Dd
SYMBOL diode -368 816 R180
WINDOW 0 32 64 Left 0
WINDOW 3 32 0 Left 0
SYMATTR InstName D7
SYMATTR Value Dd
SYMBOL diode 384 -256 R180
WINDOW 0 32 64 Left 0
WINDOW 3 32 0 Left 0
SYMATTR InstName D8
SYMATTR Value Di
SYMBOL diode 192 688 R180
WINDOW 0 32 64 Left 0
WINDOW 3 32 0 Left 0
SYMATTR InstName D9
SYMATTR Value Di
SYMBOL diode 688 -400 M180
WINDOW 0 32 64 Left 0
WINDOW 3 32 0 Left 0
SYMATTR InstName D10
SYMATTR Value Dd
SYMBOL diode 688 -256 M180
WINDOW 0 32 64 Left 0
WINDOW 3 32 0 Left 0
SYMATTR InstName D11
SYMATTR Value Dd
SYMBOL diode 688 -32 M180
WINDOW 0 32 64 Left 0
WINDOW 3 32 0 Left 0
SYMATTR InstName D12
SYMATTR Value Dd
SYMBOL diode 688 96 M180
WINDOW 0 32 64 Left 0
WINDOW 3 32 0 Left 0
SYMATTR InstName D13
SYMATTR Value Dd
SYMBOL zener 640 304 R180
WINDOW 0 0 64 Right 0
WINDOW 3 0 0 Right 0
SYMATTR InstName D14
SYMATTR Value 220V
SYMBOL zener 720 304 R180
WINDOW 0 0 64 Right 0
WINDOW 3 0 0 Right 0
SYMATTR InstName D15
SYMATTR Value 20Vb
SYMBOL zener 528 432 R180
WINDOW 0 32 64 Left 0
WINDOW 3 32 0 Left 0
SYMATTR InstName D16
SYMATTR Value 10V
SYMBOL zener 608 352 M270
WINDOW 0 36 32 VTop 0
WINDOW 3 -4 32 VBottom 0
SYMATTR InstName D17
SYMATTR Value 210V
SYMBOL zener 720 480 R180
WINDOW 0 0 64 Right 0
WINDOW 3 0 0 Right 0
SYMATTR InstName D18
SYMATTR Value 20V
SYMBOL diode 688 688 M180
WINDOW 0 32 64 Left 0
WINDOW 3 32 0 Left 0
SYMATTR InstName D19
SYMATTR Value Dd
SYMBOL diode 688 816 M180
WINDOW 0 32 64 Left 0
WINDOW 3 32 0 Left 0
SYMATTR InstName D20
SYMATTR Value Dd
TEXT 160 -576 Center 0 ;>> IRS20954 Behavioral Model by analog@ieee.org 8/2006 Rev - <<
TEXT -224 768 Left 0 !.model Di d(Ron=10)\n.model Dd d(Ron=.5 Vfwd=.5)\n.model 10V d(Ron=.5 Vfwd=.5 Vrev=10.4 Roff=12k)\n.model 20V d(Ron=.5 Vfwd=.5 Vrev=20.2 Roff=7k)\n.model 20Vb d(Ron=.5 Vfwd=.5 Vrev=20.2 Roff=22k)\n.model 210V d(Ron=.5 Vfwd=.5 Vrev=210 Roff=5e6)\n.model 220V d(Ron=.5 Vfwd=.5 Vrev=220 Roff=5e6)
TEXT 192 -480 Left 0 !.model SH sw(Vt=.5 Vh=-.5 Ron=5 Ilimit=1.0 Vser=1.2)\n.model SL sw(Vt=.5 Vh=-.5 Ron=3 Ilimit=1.2)
TEXT -264 -160 Left 0 !.model Isw sw\n+ Vt=-.5\n+ Ilimit=200u\n+ Vser=.6
TEXT -128 400 Left 0 !.model Ref sw\n+ Vt=-5.1\n+ Vh=-50m\n+ Vser=1.2\n+ Ron=10
TEXT -80 168 Right 0 ;Deadtime Generator
RECTANGLE Normal 816 928 -496 -560

The netlist it stands for:
* Circuito de Potencia.asc
XX1 VDD PWM N007 0 N011 N012 N015 N016 N013 VDD Vo1 N008 N006 N003 irs20954 params: IRS20954
C1 N006 Vo1 22n
Ct1 N007 0 10p
C2 VDD N016 22n
XM1 VDD_60 N009 Vo1 irf630  ; pins D G S
XM2 Vo1 N014 N016 irf630  ; pins D G S
D1 VDD N010 MUR460
RD1 N006 N010 10
RG1 N009 N008 20
RG2 N014 N013 20
R3 N003 Vo1 4.6k
R2 N004 N003 5.4k
R1 N006 N004 10k
D2 N004 VDD_60 MUR460
R5 N012 N016 4k
R4 N011 N012 6k
R6 VDD N015 8.2k
R7 N015 N016 3.3k
L1 Vo1 Vo 1m
C3 Vo 0 1µ
R8 0 Vo 50
R9 N017 N005 {R_2}
R10 Vo N017 {R_1}
C4 0 N017 {C_1}
C5 N018 N005 {C_2}
R11 Vo N018 {R_3}
Rp1 V_error N005 {Rp}
Cp1 V_error N005 {Cp}
XU1 0 N005 5V Vss V_error TL084  ; pins In+ In- V+ V- OUT
XU2 V_error VoscComp 5V Vss PWM LM393  ; pins In+ In- V+ V- OUT
R12 5V PWM 3k
R13 N001 N002 {Rg}
R14 N002 Vin {Rg}
R15 N005 N001 {Rg}
XU3 0 N002 5V Vss N001 TL084  ; pins In+ In- V+ V- OUT
V1 Vin 0 PULSE(0 3.2 0.5m 0.1u 0.1u 1m 2m)
V2 VDD 0 15
V3 VDD_60 0 60
V4 Vss 0 -5
R16 N020 VoscComp {R}
R17 N022 0 {R}
RF1 N021 N022 {R}
R18 N021 N023 {R}
R19 N019 0 {R}
R20 VoscComp N023 {R}
C6 N023 0 0.5n
R21 VoscComp N019 {R}
XU4 N023 N019 5V Vss VoscComp TL084  ; pins In+ In- V+ V- OUT
XU5 N022 N020 5V Vss N021 LM393  ; pins In+ In- V+ V- OUT
R22 5V N021 3k
V5 5V 0 5

* block symbol definitions
.subckt irs20954 Vdd In CSD Vss Vref OCset DT Com Lo Vcc Vs Ho Vb CsH
D1 CSD Vdd Dd
D2 Vss CSD Dd
C1 CSD Vss 10p Rpar=1e6
I1 Vdd CSD TBL(1.2 0 1.3 100u)
S1 Vss CSD 0 7 Isw
R1 Vdd 1 30k
R2 2 1 40k
R3 2 Vss 30k
A1 CSD 1 0 0 0 0 6 0 SCHMITT Vt=0 Vh=0 Td=300n tripdt=10n
A2 2 CSD 0 0 0 0 8 0 SCHMITT Vt=0 Vh=0 Td=200n tripdt=10n
D3 In Vdd Dd
D4 Vss In Dd
C2 In Vss 10p
A3 In Vss 0 0 0 4 3 0 SCHMITT Vt=1.9 Vh=0.4 Trise=50n Tfall=2n tripdt=2n
A4 3 5 0 0 0 0 10 0 SCHMITT Vt=0 Vh=0 Td=80n tripdt=5n
A5 4 5 0 0 0 0 11 0 SCHMITT Vt=0 Vh=0 Td=80n tripdt=5n
B1 0 5 I=table(V(DT,Com)/V(Vcc,Com),359m,9m,360m, 7m,569m,7m,570m,5m,889m,5m,890m,3m)
C3 5 0 1n Rpar=100
S2 Vref Vcc Com Vref Ref
A6 OCset Vs 0 0 0 0 12 0 SCHMITT Vt=-0 Vh=0 Td=50n tripdt=10n Rout=1k Cout=200p
A7 8 9 0 0 0 0 7 0 SRFLOP Td=100n tripdt=10n
A8 12 16 15 14 13 9 0 0 AND Ref=.37 Td=500n tripdt=10n
A9 0 10 6 7 14 18 17 0 AND Tau=5n tripdt=5n
A10 Vb Vs 0 0 0 0 14 0 SCHMITT Vt=8.4 Vh=.1 Td=50n tripdt=10n
A11 Vdd Vss 0 0 0 0 15 0 SCHMITT Vt=8.45 Vh=.25 Td=50n tripdt=10n
A12 Vcc Com 0 0 0 0 16 0 SCHMITT Vt=8.8 Vh=.1 Td=50n tripdt=10n
A13 16 6 7 11 0 20 19 0 AND Tau=5n tripdt=5n
A14 Vs CsH 0 0 0 0 13 0 SCHMITT Vt=-1.2 Vh=0 Td=50n tripdt=10n Rout=1k Cout=300p
S3 Ho Vb 17 0 SH
S4 Ho Vs 18 0 SL
S5 Lo Vcc 19 0 SH
S6 Lo Com 20 0 SL
D5 Com Vref Dd
C4 Vref Com 10p Rpar=1e6
C5 OCset Com 10p Rpar=1e6
C6 CsH Vs 10p Rpar=1e6
C7 Vb Ho 22p
C8 Ho Vs 27p Rpar=100k
C9 Vcc Lo 22p
C10 Lo Com 27p Rpar=100k
D6 OCset Vcc Dd
D7 Com OCset Dd
D8 18 13 Di
D9 20 12 Di
D10 CsH Vb Dd
D11 Vs CsH Dd
D12 Ho Vb Dd
D13 Vs Ho Dd
D14 Com Vb 220V
D15 Vs Vb 20Vb
D16 Vss Vdd 10V
D17 Com Vdd 210V
D18 Com Vcc 20V
D19 Lo Vcc Dd
D20 Com Lo Dd
* >> IRS20954 Behavioral Model by analog@ieee.org 8/2006 Rev - <<
.model Di d(Ron=10)
.model Dd d(Ron=.5 Vfwd=.5)
.model 10V d(Ron=.5 Vfwd=.5 Vrev=10.4 Roff=12k)
.model 20V d(Ron=.5 Vfwd=.5 Vrev=20.2 Roff=7k)
.model 20Vb d(Ron=.5 Vfwd=.5 Vrev=20.2 Roff=22k)
.model 210V d(Ron=.5 Vfwd=.5 Vrev=210 Roff=5e6)
.model 220V d(Ron=.5 Vfwd=.5 Vrev=220 Roff=5e6)
.model SH sw(Vt=.5 Vh=-.5 Ron=5 Ilimit=1.0 Vser=1.2)
.model SL sw(Vt=.5 Vh=-.5 Ron=3 Ilimit=1.2)
.model Isw sw
+ Vt=-.5
+ Ilimit=200u
+ Vser=.6
.model Ref sw
+ Vt=-5.1
+ Vh=-50m
+ Vser=1.2
+ Ron=10
* Deadtime Generator
.ends irs20954

.model D D
.lib standard.dio
* Half-Brige con Gate Driver
* Filtro
* Bloque realimentador f
.param Rg=10k
* Amplificador inversor -1/Rg
* Amplificador realimentado por
* corriente con compensador PID
.param Rp=10k Cp=1p
* Comparador
.params R=15k
* Generador de triangular de precision
* Vb Zos: 220V
* VddZos: 210V
* VccZ: 20.2V
* Vb Z: 20.2V
* VddZ: 10.4V
* Td on: 90ns+Tdt
* Td off: 90ns
* Tsd:  < 1us
* Tr on: 15ns
* Tf off: 10ns
* Tdt: 15/25/35/45ns
* Vdt: .89/.57/.36/.23
* VHin: 2.3
* VLin: 1.5
* VHsat: 1.2
* Ros: 5e6
* Rb: 12k
* Rcc: 7k
* Rdd: 22k
* Rin: 1e6
* UVL Vcc: 8.9/8.7V
* UVL Vb:  8.5/8.3V
* UVL Vdd: 8.7/8.2V
* Io+: 1.0A
* Io-: 1.2A
* Voc: 70/30 %Vdd
* Ioc: +/-100ua
* OCH: 1.2Vos
*  300ns filter
* OCL: 0.0Vos
*  200ns filter
.include irf630.lib.txt
.model MUR460 D(Is=149n Rs=.0384
+ N=2 EG=1.285 XTI=.5 BV=800
+ IBV=1e-05 Cjo=126.4p Vj=1.34
+ M=.52 tt=44.4n Iave=4 Vpk=600
+ mfg=GI type=silicon)
.MODEL BAV21W D  ( IS=1.09u
+ RS=0.105 BV=200 IBV=100n
+ CJO=5.00p  M=0.333 N=3.29
+ TT=72.0n )
.include LM393.5_1
.include TL084.301
.tran 1.5m
.param R_1=100k R_2=500k
+ R_3=1k C_1=0.01n C_2=1n
* If
.backanno
.end